# EasyEDA Pro project smart-home-weather-station-v1.epro

# Schematic Schematic1
Board Name: Board1; Create Date: 2026-08-30; Page Name: P1; Project Name: smart-home-weather-station-v1; Schematic Name: Schematic1; Update Date: 2026-08-30; Company: EasyEDA.com; Page Size: A4; Version: V1.0
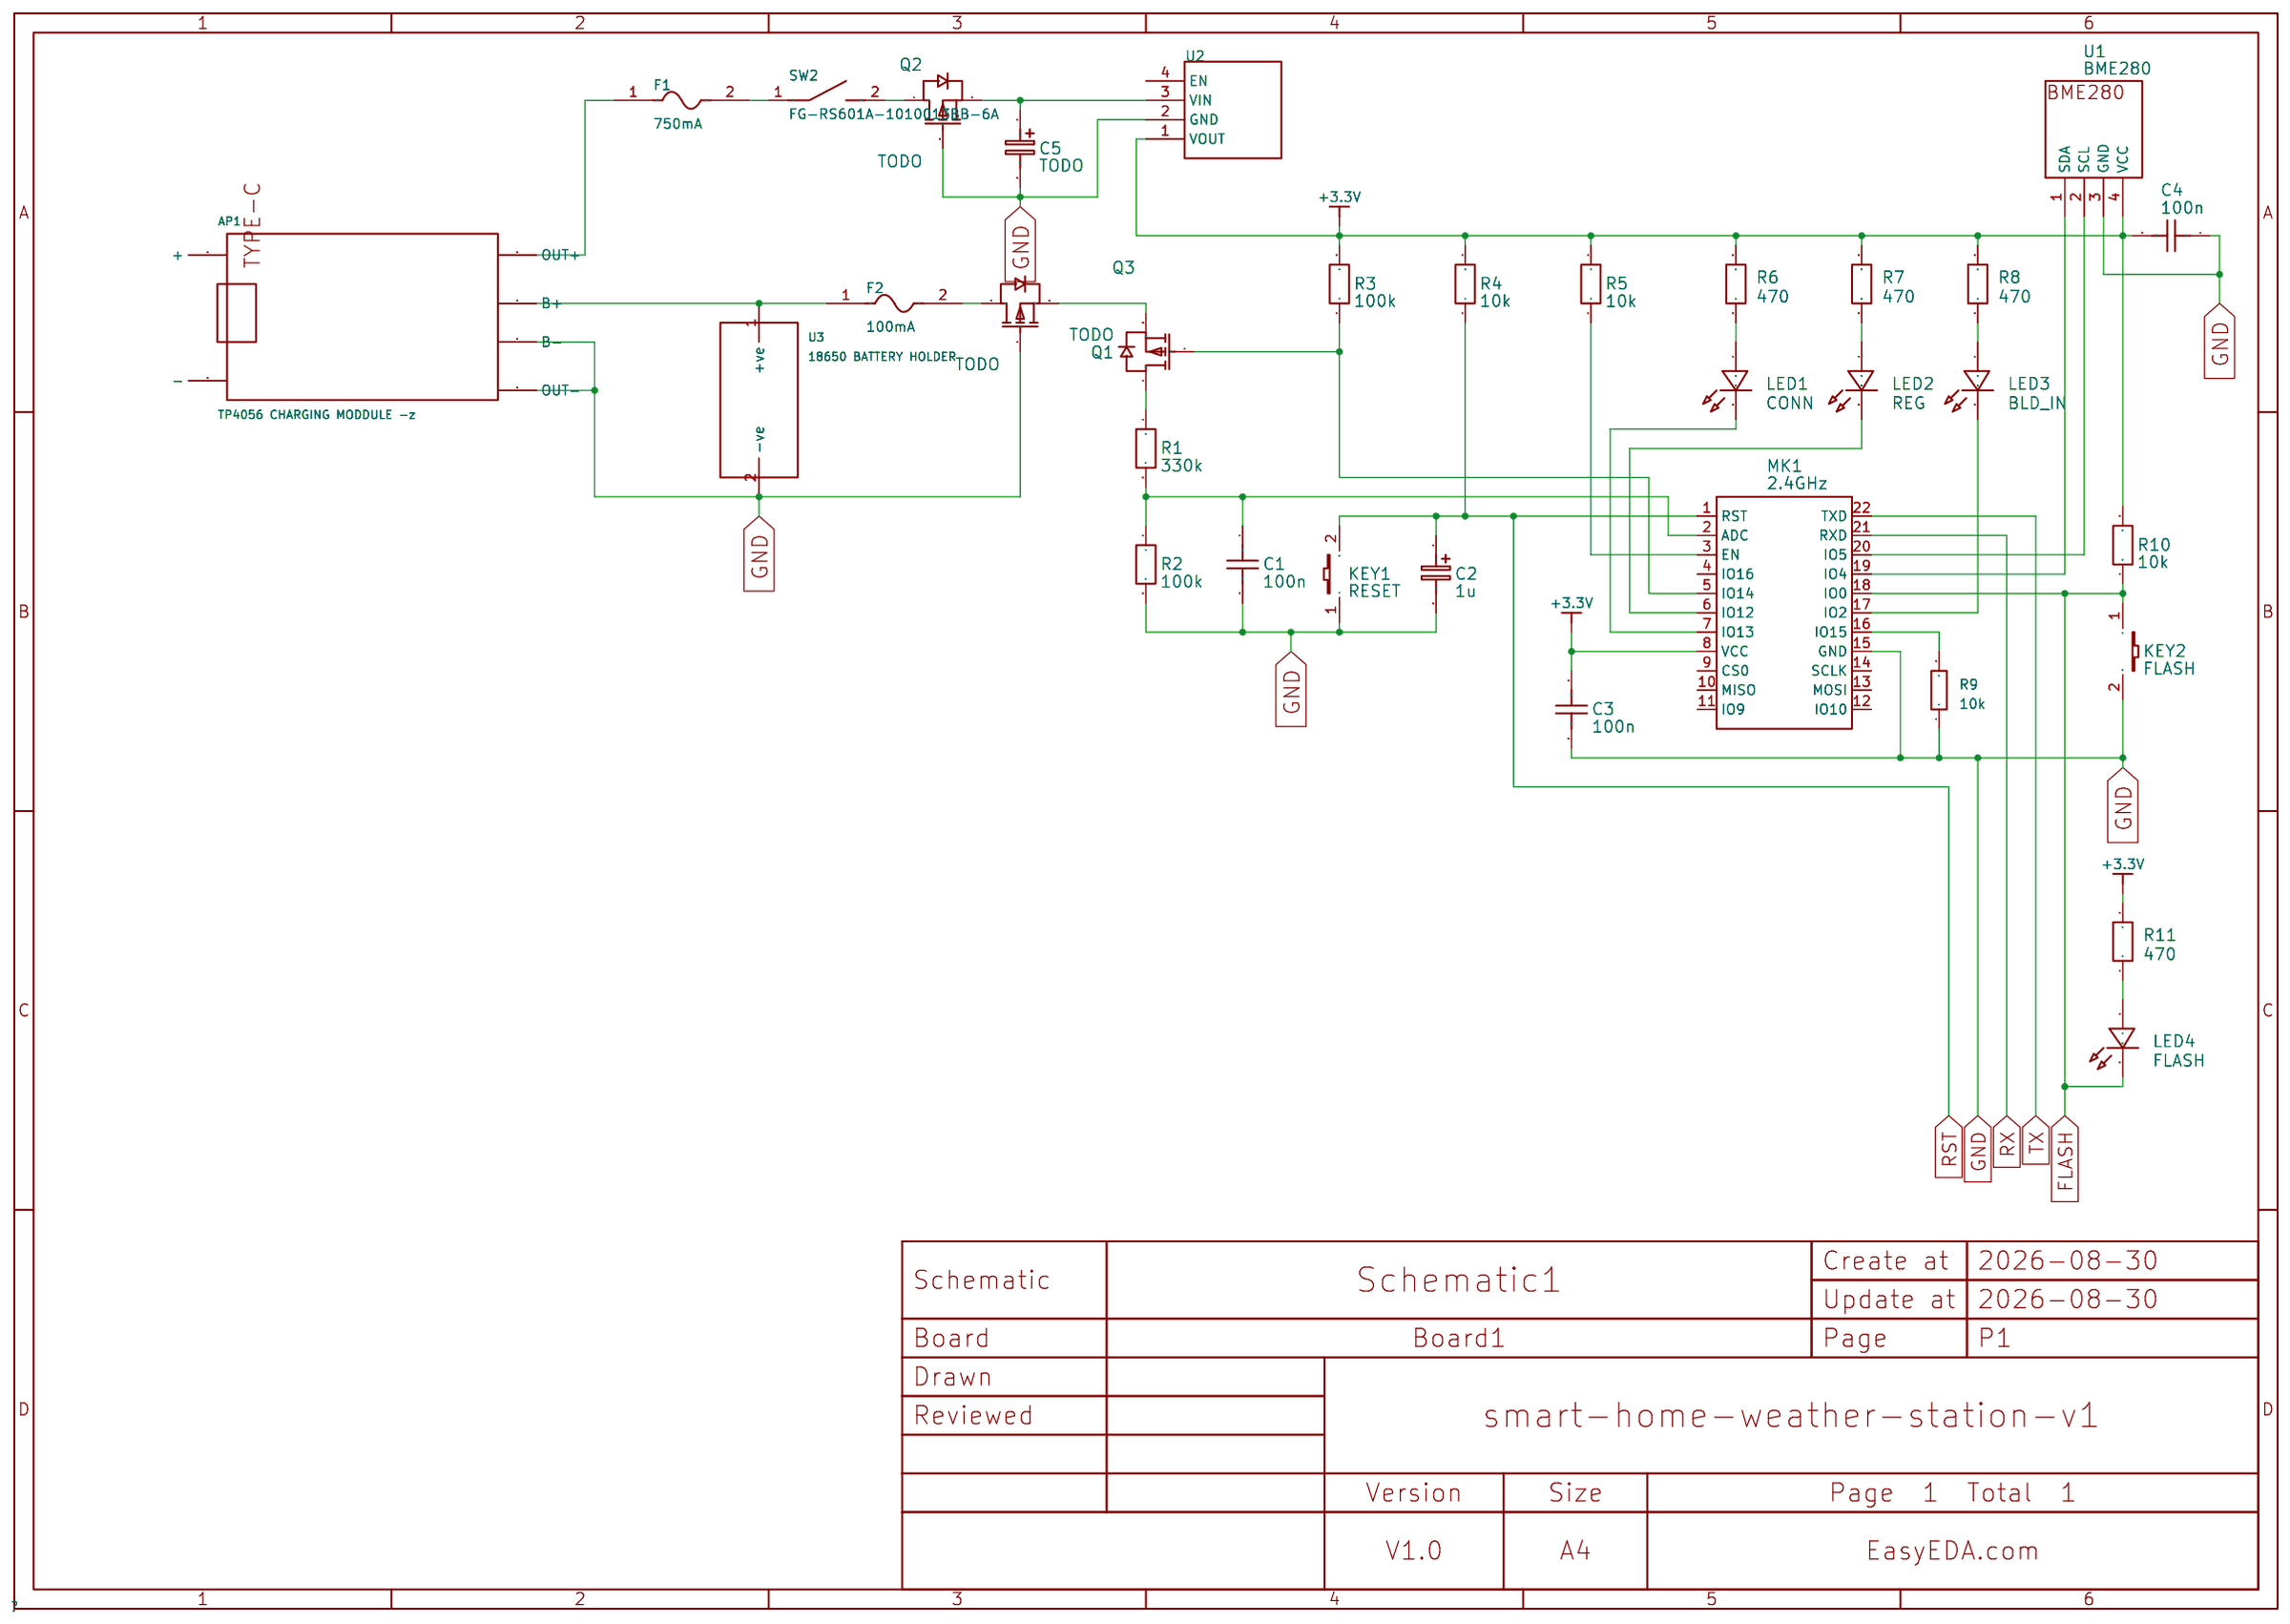
[diagram p0: schematic sheet]

## Parts
AP1  TP4056 CHARGING MODDULE -z  [TP4056-CHARGING-MODULE_TP4056]
C1  100n  [C0603]
C2  1u  [CASE-A_3216]
C3  100n  [C0603]
C4  100n  [C0603]
C5  TODO  [CASE-A_3216]
F1  750mA  [F1210]
F2  100mA  [F1210]
KEY1  RESET  [KEY-SMD_2P-L6.2-W3.6-LS8.0]
KEY2  FLASH  [KEY-SMD_2P-L6.2-W3.6-LS8.0]
LED1  CONN  [LED0603_RED]
LED2  REG  [LED0603_RED]
LED3  BLD_IN  [LED0603_RED]
LED4  FLASH  [LED0603_RED]
MK1  2.4GHz  [WIFIM-SMD_ESP-12E-BR]
Q1  TODO  [TO-263-2_L10.0-W9.1-P5.08-LS15.2-BR]
Q2  TODO  [TO-263-2_L10.0-W9.1-P5.08-LS15.2-BR]
Q3  TODO  [TO-263-2_L10.0-W9.1-P5.08-LS15.2-BR]
R1  330k  [R0603]
R2  100k  [R0603]
R3  100k  [R0603]
R4  10k  [R0603]
R5  10k  [R0603]
R6  470  [R0603]
R7  470  [R0603]
R8  470  [R0603]
R9  10K  [R0603]
R10  10k  [R0603]
R11  470  [R0603]
SW2  FG-RS601A-1010013BB-6A  [SW-TH_FG-RS601A-1010013BB-6A]
U1  BME280
U2  -  [S8V9F3]
U3  18650 BATTERY HOLDER  [18650 BATTERY HOLDER CB-18650-PC2]

## Library data of the parts
AP1 = TP4056 CHARGING MODDULE -z: Manufacturer Part: TP4056
C1 C3 C4 = 100n
C2 C5 = 1u
F1 F2 = 1210L150/16WR: Supplier Part: C9900015772; Supplier Footprint: PTC_1.5A/16V; JLCPCB Part Class: Extended Part; Supplier: LCSC
KEY1 KEY2 = K2-1107ST-A4SW-06: Supplier Part: C118141; Supplier: LCSC; 制造商: 韩国韩荣
LED1-LED4 = 19-217/R6C-AL1M2VY/3T: Manufacturer: EVERLIGHT(台湾亿光); Supplier Part: C72044; Supplier: LCSC
MK1 = ESP-12E: Supplier: LCSC; Manufacturer: Ai-Thinker(安信可); Supplier Part: C89297; JLCPCB Part Class: Extended Part
Q1-Q3 = IRF5210STRLPBF: Supplier: LCSC; Manufacturer: IR; image: //image.lceda.cn/szlcsc/C2622.jpg; Supplier Part: C2622; Paste Type: expand
R1 = 330k
R2 R3 = 100k
R4 R5 R10 = 10k
R6-R8 R11 = 470
R9 = Res_0603: Supplier Footprint: 0603
SW2 = FG-RS601A-1010013BB-6A: Supplier Part: C54529748; Manufacturer: FG(富港); Supplier Footprint: 插件; JLCPCB Part Class: Extended Part; Datasheet: https://item.szlcsc.com/datasheet/FG-RS601A-1010013BB-6A/57881949.html; Supplier: LCSC
U1 = BME280
U2 = S8V9F3
U3 = 18650 BATTERY HOLDER

## Nets
+3.3V: C3.1 C4.2 MK1.8(VCC) R3.2 R4.2 R5.2 R6.2 R7.2 R8.2 R10.2 R11.2 U1.4(VCC) U2.1(VOUT)
GND: AP1.2(B-) AP1.4(OUT-) C1.2 C2.2 C3.2 C4.1 C5.2 KEY1.1 KEY2.2 MK1.15(GND) Q2.1(G) Q3.1(G) R2.2 R9.1 U1.3(GND) U2.2(GND) U3.2(-ve)
FLASH: KEY2.1 LED4.2 MK1.18(IO0) R10.1
RST: C2.1 KEY1.2 MK1.1(RST) R4.1
RX: MK1.21(RXD)
TX: MK1.22(TXD)
Net-(AP1-1): AP1.1(B+) F2.1 U3.1(+ve)
Net-(AP1-3): AP1.3(OUT+) F1.1
Net-(C1-1): C1.1 MK1.2(ADC) R1.2 R2.1
Net-(C5-1): C5.1 Q2.3(S) U2.3(VIN)
Net-(F1-2): F1.2 SW2.1
Net-(F2-2): F2.2 Q3.4(D)
Net-(LED1-1): LED1.1 R6.1
Net-(LED1-2): LED1.2 MK1.7(IO13)
Net-(LED2-1): LED2.1 R7.1
Net-(LED2-2): LED2.2 MK1.6(IO12)
Net-(LED3-1): LED3.1 R8.1
Net-(LED3-2): LED3.2 MK1.17(IO2)
Net-(LED4-1): LED4.1 R11.1
Net-(MK1-3): MK1.3(EN) R5.1
Net-(MK1-5): MK1.5(IO14) Q1.1(G) R3.1
Net-(MK1-16): MK1.16(IO15) R9.2
Net-(MK1-19): MK1.19(IO4) U1.1(SDA)
Net-(MK1-20): MK1.20(IO5) U1.2(SCL)
Net-(Q1-3): Q1.3(S) Q3.3(S)
Net-(Q1-4): Q1.4(D) R1.1
Net-(Q2-4): Q2.4(D) SW2.2

Not connected (* = marked no-connect by the designer): AP1 5(+) 6(-); MK1 4(IO16) 9(CS0) 10(MISO) 11(IO9) 12(IO10) 13(MOSI) 14(SCLK); U2 4(EN)
